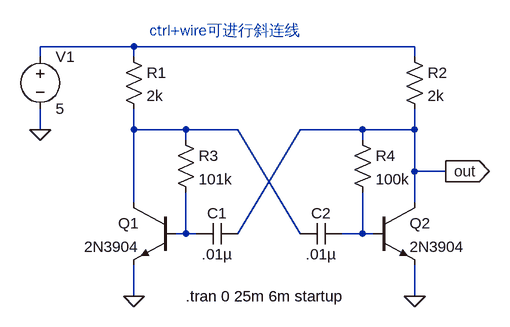
[diagram p0: schematic Draft1.asc]
Draft1.asc, the LTspice schematic file:
Version 4.1
SHEET 1 880 680
WIRE 32 80 -112 80
WIRE 464 80 32 80
WIRE -112 96 -112 80
WIRE 32 96 32 80
WIRE 464 96 464 80
WIRE -112 208 -112 176
WIRE 32 208 32 176
WIRE 112 208 32 208
WIRE 192 208 112 208
WIRE 384 208 288 208
WIRE 464 208 464 176
WIRE 464 208 384 208
WIRE 112 224 112 208
WIRE 384 224 384 208
WIRE 464 272 464 208
WIRE 512 272 464 272
WIRE 32 320 32 208
WIRE 464 320 464 272
WIRE 112 368 112 304
WIRE 112 368 96 368
WIRE 128 368 112 368
WIRE 192 368 288 208
WIRE 288 368 192 208
WIRE 384 368 384 304
WIRE 384 368 352 368
WIRE 400 368 384 368
WIRE 32 464 32 416
WIRE 464 464 464 416
FLAG -112 208 0
FLAG 32 464 0
FLAG 464 464 0
FLAG 512 272 out
IOPIN 512 272 Out
SYMBOL res 16 80 R0
SYMATTR InstName R1
SYMATTR Value 2k
SYMBOL res 448 80 R0
SYMATTR InstName R2
SYMATTR Value 2k
SYMBOL res 96 208 R0
SYMATTR InstName R3
SYMATTR Value 101k
SYMBOL res 368 208 R0
SYMATTR InstName R4
SYMATTR Value 100k
SYMBOL cap 192 352 R90
WINDOW 0 0 32 VBottom 2
WINDOW 3 32 32 VTop 2
SYMATTR InstName C1
SYMATTR Value .01µ
SYMBOL cap 352 352 R90
WINDOW 0 0 32 VBottom 2
WINDOW 3 32 32 VTop 2
SYMATTR InstName C2
SYMATTR Value .01µ
SYMBOL npn 96 320 M0
SYMATTR InstName Q1
SYMATTR Value 2N3904
SYMBOL npn 400 320 R0
SYMATTR InstName Q2
SYMATTR Value 2N3904
SYMBOL voltage -112 80 R0
SYMATTR InstName V1
SYMATTR Value 5
TEXT 112 464 Left 2 !.tran 0 25m 6m startup
TEXT 56 56 Left 2 ;ctrl+wire可进行斜连线

The netlist it stands for:
* Draft1.asc
R1 N001 N002 2k
R2 N001 out 2k
R3 N002 N003 101k
R4 out N004 100k
C1 out N003 .01µ
C2 N004 N002 .01µ
Q1 N002 N003 0 0 2N3904
Q2 out N004 0 0 2N3904
V1 N001 0 5
.model NPN NPN
.model PNP PNP
.lib standard.bjt
.tran 0 25m 6m startup
* ctrl+wire可进行斜连线
.backanno
.end